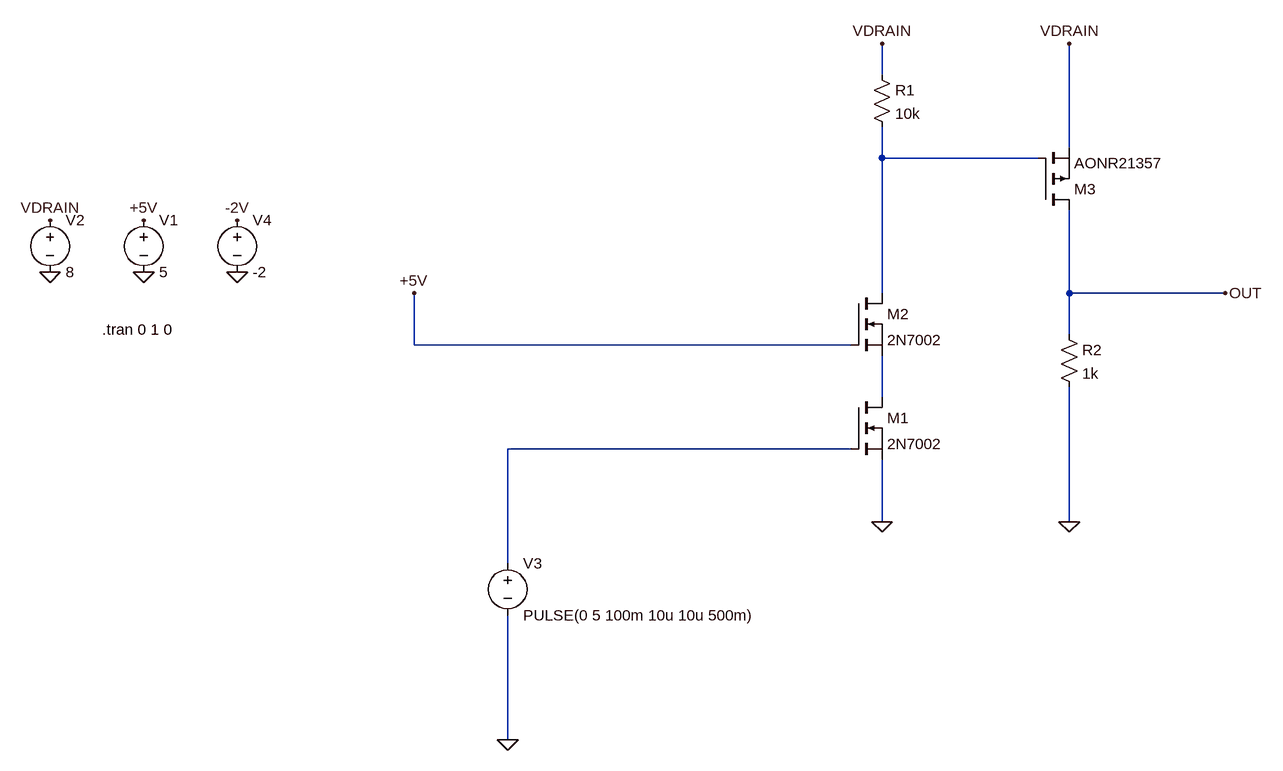
[diagram p0: schematic Draft2.asc]
Draft2.asc, the LTspice schematic file:
Version 4
SHEET 1 880 740
WIRE 192 -400 192 -448
WIRE 480 -288 480 -448
WIRE 192 -272 192 -320
WIRE 432 -272 192 -272
WIRE 192 -64 192 -272
WIRE 480 -64 480 -192
WIRE 720 -64 480 -64
WIRE 480 0 480 -64
WIRE -528 16 -528 -64
WIRE 144 16 -528 16
WIRE 192 96 192 32
WIRE 144 176 -384 176
WIRE 192 288 192 192
WIRE 480 288 480 80
WIRE -384 352 -384 176
WIRE -384 624 -384 432
FLAG -528 -64 +5V
FLAG -944 -176 +5V
FLAG -944 -96 0
FLAG -1088 -176 VDRAIN
FLAG -1088 -96 0
FLAG 480 -448 VDRAIN
FLAG 192 288 0
FLAG 192 -448 VDRAIN
FLAG -384 624 0
FLAG 480 288 0
FLAG 720 -64 OUT
FLAG -800 -176 -2V
FLAG -800 -96 0
SYMBOL nmos 144 96 R0
SYMATTR InstName M1
SYMATTR Value 2N7002
SYMBOL nmos 144 -64 R0
SYMATTR InstName M2
SYMATTR Value 2N7002
SYMBOL pmos 432 -192 M180
SYMATTR InstName M3
SYMATTR Value AONR21357
SYMBOL voltage -944 -192 R0
WINDOW 123 0 0 Left 0
WINDOW 39 0 0 Left 0
SYMATTR InstName V1
SYMATTR Value 5
SYMBOL voltage -1088 -192 R0
WINDOW 123 0 0 Left 0
WINDOW 39 0 0 Left 0
SYMATTR InstName V2
SYMATTR Value 8
SYMBOL res 176 -416 R0
SYMATTR InstName R1
SYMATTR Value 10k
SYMBOL voltage -384 336 R0
WINDOW 123 0 0 Left 0
WINDOW 39 0 0 Left 0
SYMATTR InstName V3
SYMATTR Value PULSE(0 5 100m 10u 10u 500m)
SYMBOL res 464 -16 R0
SYMATTR InstName R2
SYMATTR Value 1k
SYMBOL voltage -800 -192 R0
WINDOW 123 0 0 Left 0
WINDOW 39 0 0 Left 0
SYMATTR InstName V4
SYMATTR Value -2
TEXT -1008 -8 Left 2 !.tran 0 1 0

The netlist it stands for:
* Draft2.asc
M1 N002 N003 0 0 2N7002
M2 N001 +5V N002 N002 2N7002
M3 OUT N001 VDRAIN VDRAIN AONR21357
V1 +5V 0 5
V2 VDRAIN 0 8
R1 VDRAIN N001 10k
V3 N003 0 PULSE(0 5 100m 10u 10u 500m)
R2 OUT 0 1k
V4 -2V 0 -2
.model NMOS NMOS
.model PMOS PMOS
.lib standard.mos
.tran 0 1 0
.backanno
.end